# EAGLE design ttp224n_breadboard_kits (EAGLE 7.7.0)
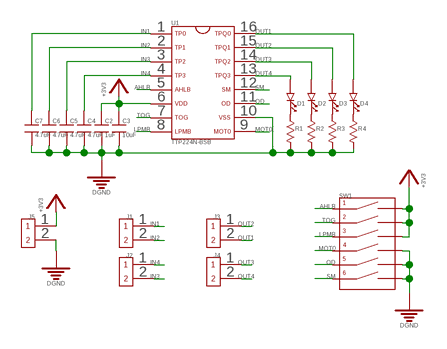
[diagram p0: schematic, sheet 1]

## Parts
C2  1uF  CAPACITOR_FIXED_0805  [0805]
C3  10uF  CAPACITOR_FIXED_0805  [0805]
C4  4.7uF  CAPACITOR_FIXED_0805  [0805]
C5  4.7uF  CAPACITOR_FIXED_0805  [0805]
C6  4.7uF  CAPACITOR_FIXED_0805  [0805]
C7  4.7uF  CAPACITOR_FIXED_0805  [0805]
D1  LED-0805  [0805DIODE]
D2  LED-0805  [0805DIODE]
D3  LED-0805  [0805DIODE]
D4  LED-0805  [0805DIODE]
J1  2PIN_HEADER_PITCH2.54MM_TH  [2PIN_HEADER_PITCH2.54MM_TH]
J2  2PIN_HEADER_PITCH2.54MM_TH  [2PIN_HEADER_PITCH2.54MM_TH]
J3  2PIN_HEADER_PITCH2.54MM_TH  [2PIN_HEADER_PITCH2.54MM_TH]
J4  2PIN_HEADER_PITCH2.54MM_TH  [2PIN_HEADER_PITCH2.54MM_TH]
J5  2PIN_HEADER_PITCH2.54MM_TH  [2PIN_HEADER_PITCH2.54MM_TH]
R1  RESISTOR_0805  [0805]
R2  RESISTOR_0805  [0805]
R3  RESISTOR_0805  [0805]
R4  RESISTOR_0805  [0805]
SW1  DIP_SWITCH_6PIN-219-6MST  [DIP_SW_219-6MST]
U1  TTP224N-BSB  [SSOP-16]

## Nets
+3V3: C2.1 C3.1 J5.1 SW1.2(1.1) SW1.4(2.1) SW1.6(3.1) U1.6
AHLB: SW1.1(1.0) U1.5
DGND: C2.2 C3.2 C4.2 C5.2 C6.2 C7.2 J5.2 R1.2 R2.2 R3.2 R4.2 SW1.8(4.1) SW1.10(5.1) SW1.12(6.1) U1.10
IN1: C7.1 J1.1 U1.1
IN2: C6.1 J1.2 U1.2
IN3: C5.1 J2.2 U1.3
IN4: C4.1 J2.1 U1.4
LPMB: SW1.5(3.0) U1.8
MOT0: SW1.7(4.0) U1.9
N$1: D1.1(K) R1.1
N$3: D2.1(K) R2.1
N$4: D3.1(K) R3.1
N$5: D4.1(K) R4.1
OD: SW1.9(5.0) U1.11
OUT1: D4.2(A) J3.2 U1.16
OUT2: D3.2(A) J3.1 U1.15
OUT3: D2.2(A) J4.1 U1.14
OUT4: D1.2(A) J4.2 U1.13
SM: SW1.11(6.0) U1.12
TOG: SW1.3(2.0) U1.7

## Library data of the parts
C2-C7 = Capacitors:CAPACITOR_FIXED
D1-D4 = LEDs:LED
J1-J5 = Connectors:2PIN
R1-R4 = Resistors:RESISTOR
SW1 = Switches:DIP_SWITCH_6PIN
U1 = ICs:TTP224N-BSB

## Board
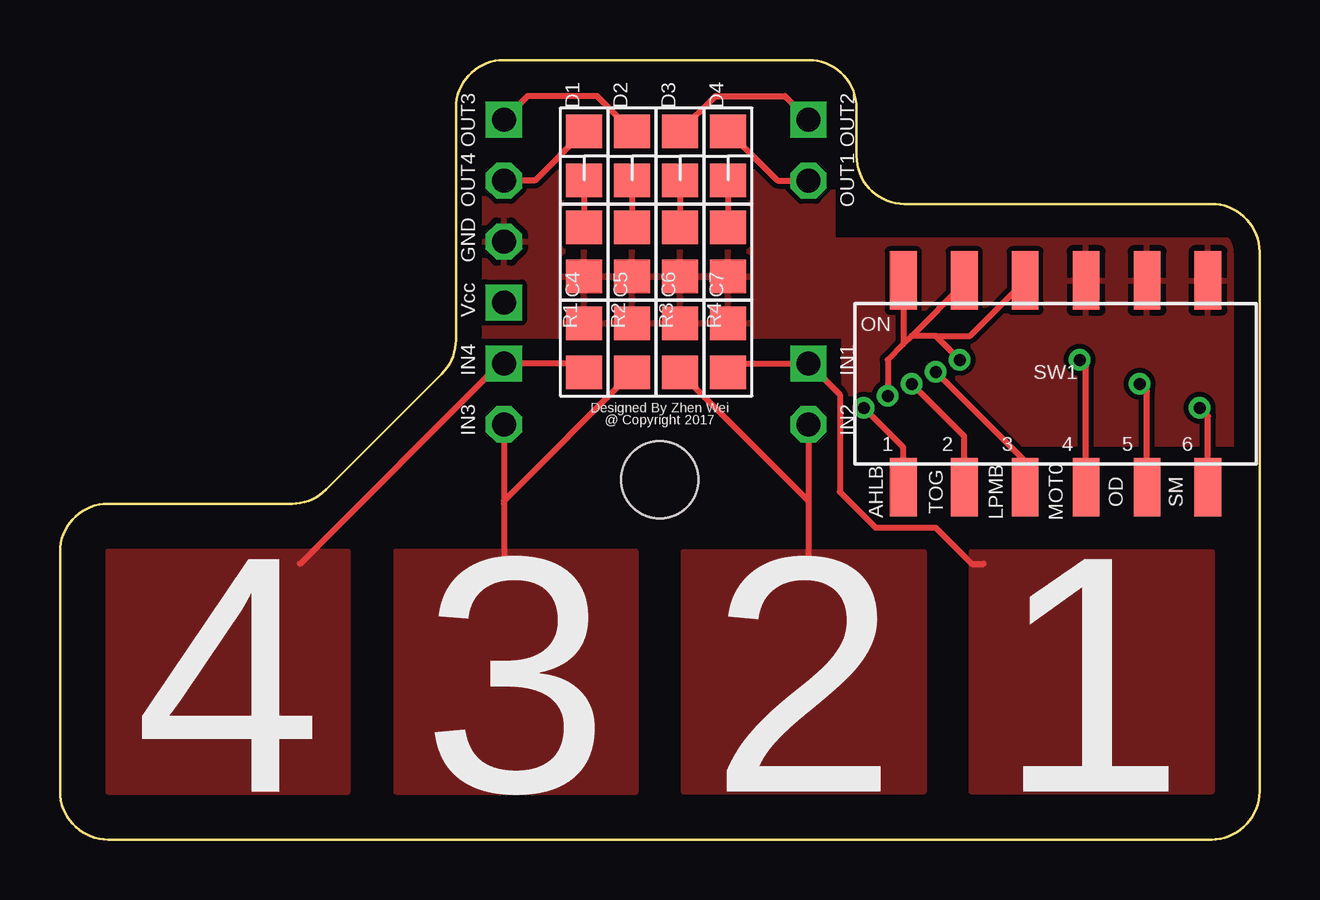
[diagram p1: board, top side]
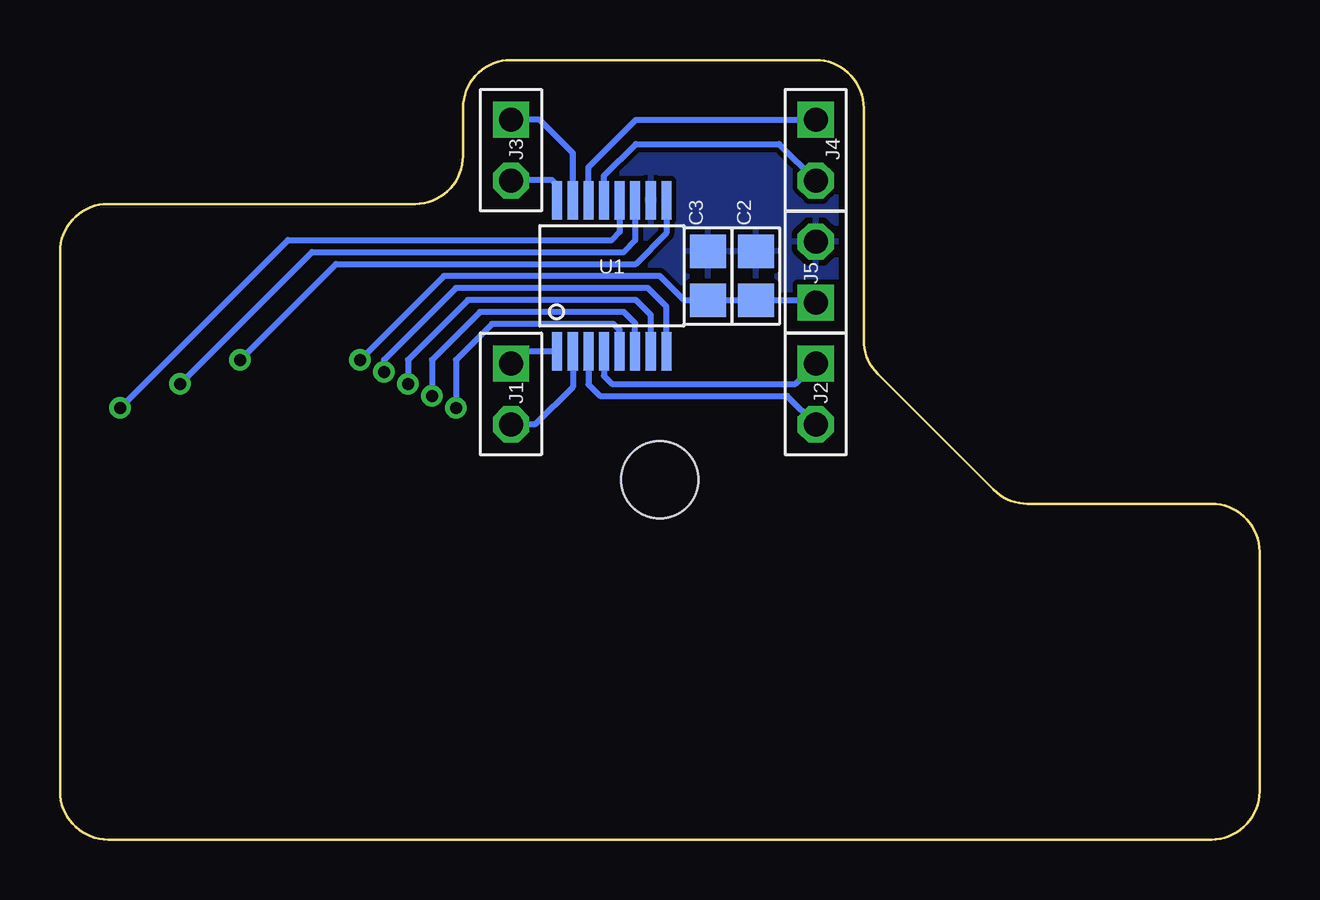
[diagram p2: board, bottom side, seen from below]

Size 50 x 32.5 mm. Coordinates in mm from the lower left corner, seen from the top.
Outline: 50,2 50,24.5 arc90 48,26.5 35.2,26.5 arc-90 33.2,28.5 33.2,30.5 arc90 31.2,32.5 18.5,32.5 arc90 16.5,30.5 16.5,20.83 arc-45 15.91,19.41 11.09,14.59 arc-45 9.67,14 2,14 arc90 0,12 0,2 arc90 2,0 48,0 arc90 50,2
Copper layers (1*16): Top 0.035mm / dielectric 1.5mm / Bottom 0.035mm
Design rules "default": minimum track width 10mil, minimum drill 24mil, track to track 8mil, track to pad 8mil, pad to pad 8mil, via to via 8mil, smd to smd 8mil, copper to edge 40mil, drill to drill 8mil, minimum pad ring 10mil, minimum via ring 8mil, stop-mask expansion 4mil, vias tented up to drill 0mil, thermal gap 10mil
Holes 3.2 mm at 25,15

### Footprints (pad centres in the part's own frame; a part is rotated, then mirrored left to right if it is on the bottom)
0805 = smd 1.4 x 1.5: 1 -1.025,0; 2 1.025,0
0805DIODE = smd 1.4 x 1.5: 1 -1.025,0; 2 1.025,0
2PIN_HEADER_PITCH2.54MM_TH = drill 1 square: 1 -1.27,0 | drill 1 octagon: 2 1.27,0
DIP_SW_219-6MST = smd 1.12 x 2.44: 1 -6.35,-4.305; 2 -6.35,4.305; 3 -3.81,-4.305; 4 -3.81,4.305; 5 -1.27,-4.305; 6 -1.27,4.305; 7 1.27,-4.305; 8 1.27,4.305; 9 3.81,-4.305; 10 3.81,4.305; 11 6.35,-4.305; 12 6.35,4.305
SSOP-16 = smd 0.42 x 1.6: 1 -2.275,-3.15; 2 -1.625,-3.15; 3 -0.975,-3.15; 4 -0.325,-3.15; 5 0.325,-3.15; 6 0.975,-3.15; 7 1.625,-3.15; 8 2.275,-3.15; 9 2.275,3.15; 10 1.625,3.15; 11 0.975,3.15; 12 0.325,3.15; 13 -0.325,3.15; 14 -0.975,3.15; 15 -1.625,3.15; 16 -2.275,3.15

### Placement (x,y rotation side)
C2  21,23.5 90 bottom
C3  23,23.5 90 bottom
C4  21.85,20.5 90 top
C5  23.85,20.5 90 top
C6  25.85,20.5 90 top
C7  27.85,20.5 90 top
D1  21.85,28.5 90 top
D2  23.85,28.5 90 top
D3  25.85,28.5 90 top
D4  27.85,28.5 90 top
J1  31.2,18.58 270 bottom
J2  18.5,18.58 270 bottom
J3  31.2,28.74 270 bottom
J4  18.5,28.74 270 bottom
J5  18.5,23.66 90 bottom
R1  21.85,24.5 270 top
R2  23.85,24.5 270 top
R3  25.85,24.5 270 top
R4  27.85,24.5 270 top
SW1  41.5,19 0 top
U1  27,23.5 0 bottom

### Tracks (layer width: path | path; a pad name or v marks a point on that pad's centre or on a via)
+3V3  (via drill 0.5)
  Top 0.254: SW1.2 35.15,20.65 | 35.15,20.65 34.5,20 v34.5,18.5 | 35.15,20.65 35.5,21 | 35.5,21 37.69,23.19 SW1.4 | v37.5,20 36.5,21 | 36.5,21 35.5,21 | 36.5,21 37.92,21 SW1.6
  Bottom 0.254: U1.6 26.02,21.52 26.5,22 32.5,22 34.5,20 v34.5,18.5 | v37.5,20 34,23.5 25,23.5 23.98,22.48 C3.1 C2.1 18.59,22.48 J5.1
AHLB  (via drill 0.5)
  Top 0.254: SW1.1 35.15,16.35 v33.5,18
  Bottom 0.254: v33.5,18 33.5,20 32,21.5 26.93,21.5 26.68,21.25 U1.5
DGND
  pour Bottom: 17.5,31 32.2,31 32.2,25 49,25 49,16.5 32.7,16.5 32.7,21 17.5,21
  pour Top: 17.5,31 32.2,31 32.2,25 49,25 49,16.5 32.7,16.5 32.7,21 17.5,21
IN1
  Top 0.254: 38.5,11.5 38,11.5 36.5,13 34,13 32.5,14.5 32.5,18.55 J1.1 28.23,19.85 C7.1
  Bottom 0.254: U1.1 30.7,20.35 J1.1
  pour Top: 38,12 48,12 48,2 38,2
IN2
  Top 0.254: J1.2 31.2,14.12 | 31.2,11.5 31.2,14 31.2,14.12 | C6.1 31.2,14.12
  Bottom 0.254: U1.2 28.62,18.88 30.19,17.31 J1.2
  pour Top: 26,12 36,12 36,2 26,2
IN3
  Top 0.254: C5.1 18.5,14.12 | 18.5,14.12 18.5,14 18.5,11.5 | J2.2 18.5,14.12
  Bottom 0.254: U1.3 27.98,18.98 27.5,18.5 19.69,18.5 J2.2
  pour Top: 24,12 14,12 14,2 24,2
IN4
  Top 0.254: C4.1 21.48,19.85 J2.1 18.35,19.85 10,11.5
  Bottom 0.254: U1.4 27.32,19.32 27,19 19.35,19 J2.1
  pour Top: 12,12 2,12 2,2 12,2
LPMB  (via drill 0.5)
  Top 0.254: SW1.5 40.23,15.77 v36.5,19.5
  Bottom 0.254: U1.8 24.73,22.23 25.5,23 33.5,23 36.5,20 v36.5,19.5
MOT0  (via drill 0.5)
  Top 0.254: SW1.7 42.77,19.73 v42.5,20
  Bottom 0.254: U1.9 24.73,25.27 26,24 38.5,24 v42.5,20
N$1
  Top 0.254: D1.1 R1.1
N$3
  Top 0.254: D2.1 R2.1
N$4
  Top 0.254: D3.1 R3.1
N$5
  Top 0.254: D4.1 R4.1
OD  (via drill 0.5)
  Top 0.254: SW1.9 45.31,18.69 v45,19
  Bottom 0.254: v45,19 39.5,24.5 26.5,24.5 26.02,24.98 U1.11
OUT1
  Top 0.254: D4.2 29.91,27.47 J3.2
  Bottom 0.254: U1.16 29.27,27.27 29.5,27.5 31.17,27.5 J3.2
OUT2
  Top 0.254: D3.2 27.32,31 30.21,31 J3.1
  Bottom 0.254: U1.15 28.62,28.62 30.01,30.01 J3.1
OUT3
  Top 0.254: D2.2 22.38,31 19.49,31 J4.1
  Bottom 0.254: U1.14 27.98,28.02 25.99,30.01 J4.1
OUT4
  Top 0.254: D1.2 19.8,27.47 J4.2
  Bottom 0.254: U1.13 27.32,27.68 26,29 20.03,29 J4.2
SM  (via drill 0.5)
  Top 0.254: SW1.11 47.85,17.65 v47.5,18
  Bottom 0.254: v47.5,18 40.5,25 27,25 26.68,25.32 U1.12
TOG  (via drill 0.5)
  Top 0.254: SW1.3 37.69,16.81 v35.5,19
  Bottom 0.254: U1.7 25.38,21.88 26,22.5 33,22.5 35.5,20 v35.5,19

### Text on the board
tPlace: OUT3 | OUT2 | OUT4 | OUT1 | GND | Vcc | IN4 | IN1 | IN3 | @ Copyright 2017 | Designed By Zhen Wei | IN2 | AHLB | TOG | LPMB | MOT0 | OD | SM | 4 | 3 | 2 | 1